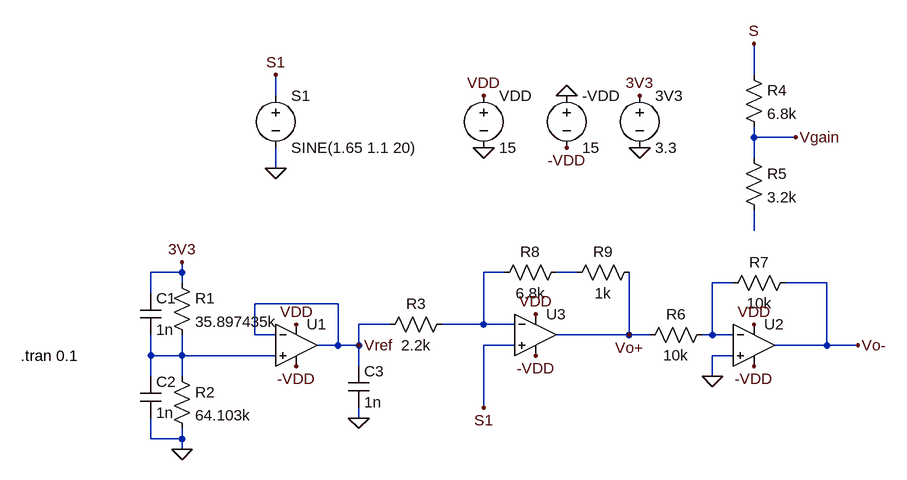
[diagram p0: schematic Arduino_mirror_adjust_1signal_non-inverting.asc]
Arduino_mirror_adjust_1signal_non-inverting.asc, the LTspice schematic file:
Version 4
SHEET 1 880 680
WIRE 624 -128 624 -176
WIRE -112 -96 -112 -128
WIRE 624 -32 624 -48
WIRE 688 -32 624 -32
WIRE 624 0 624 -32
WIRE -112 16 -112 -16
WIRE 624 112 624 80
WIRE -256 176 -256 160
WIRE -256 176 -304 176
WIRE 240 176 208 176
WIRE 352 176 320 176
WIRE -256 192 -256 176
WIRE 592 192 560 192
WIRE 736 192 672 192
WIRE -304 208 -304 176
WIRE -16 224 -144 224
WIRE 64 256 16 256
WIRE 208 256 208 176
WIRE 208 256 144 256
WIRE 256 256 208 256
WIRE -144 272 -144 224
WIRE -112 272 -144 272
WIRE 432 272 432 176
WIRE 432 272 320 272
WIRE 464 272 432 272
WIRE 560 272 560 192
WIRE 560 272 544 272
WIRE 592 272 560 272
WIRE -16 288 -16 224
WIRE -16 288 -48 288
WIRE 16 288 16 256
WIRE 16 288 -16 288
WIRE 256 288 208 288
WIRE 736 288 736 192
WIRE 736 288 656 288
WIRE 784 288 736 288
WIRE -304 304 -304 272
WIRE -256 304 -256 272
WIRE -256 304 -304 304
WIRE -112 304 -256 304
WIRE 592 304 560 304
WIRE 16 320 16 288
WIRE -304 336 -304 304
WIRE -256 336 -256 304
WIRE 560 336 560 304
WIRE 208 384 208 288
WIRE 16 400 16 384
WIRE -304 432 -304 400
WIRE -256 432 -256 416
WIRE -256 432 -304 432
WIRE -256 448 -256 432
FLAG 208 -16 0
FLAG -112 16 0
FLAG 448 -16 0
FLAG 208 -96 VDD
FLAG -256 448 0
FLAG 448 -96 3V3
FLAG -256 160 3V3
FLAG -112 -128 S1
FLAG 208 384 S1
FLAG 288 240 VDD
FLAG 624 -176 S
FLAG 688 -32 Vgain
FLAG 336 -96 0
FLAG 336 -16 -VDD
FLAG 288 304 -VDD
FLAG -80 320 -VDD
FLAG 624 320 -VDD
FLAG -80 256 VDD
FLAG 624 256 VDD
FLAG 560 336 0
FLAG 432 272 Vo+
FLAG 784 288 Vo-
FLAG 16 400 0
FLAG 16 288 Vref
SYMBOL Opamps\\UniversalOpamp2 -80 288 R0
SYMATTR InstName U1
SYMBOL Opamps\\UniversalOpamp2 624 288 R0
SYMATTR InstName U2
SYMBOL Opamps\\UniversalOpamp2 288 272 R0
SYMATTR InstName U3
SYMBOL voltage -112 -112 R0
WINDOW 123 0 0 Left 0
WINDOW 39 0 0 Left 0
SYMATTR InstName S1
SYMATTR Value SINE(1.65 1.1 20)
SYMBOL voltage 208 -112 R0
WINDOW 123 0 0 Left 0
WINDOW 39 0 0 Left 0
SYMATTR InstName VDD
SYMATTR Value 15
SYMBOL res -272 176 R0
SYMATTR InstName R1
SYMATTR Value 35.897435k
SYMBOL res -272 320 R0
SYMATTR InstName R2
SYMATTR Value 64.103k
SYMBOL voltage 448 -112 R0
WINDOW 123 0 0 Left 0
WINDOW 39 0 0 Left 0
SYMATTR InstName 3V3
SYMATTR Value 3.3
SYMBOL res 160 240 R90
WINDOW 0 0 56 VBottom 2
WINDOW 3 32 56 VTop 2
SYMATTR InstName R3
SYMATTR Value 2.2k
SYMBOL res 608 -144 R0
SYMATTR InstName R4
SYMATTR Value 6.8k
SYMBOL res 608 -16 R0
SYMATTR InstName R5
SYMATTR Value 3.2k
SYMBOL voltage 336 -112 R0
WINDOW 123 0 0 Left 0
WINDOW 39 0 0 Left 0
SYMATTR InstName -VDD
SYMATTR Value 15
SYMBOL res 560 256 R90
WINDOW 0 0 56 VBottom 2
WINDOW 3 32 56 VTop 2
SYMATTR InstName R6
SYMATTR Value 10k
SYMBOL res 688 176 R90
WINDOW 0 0 56 VBottom 2
WINDOW 3 32 56 VTop 2
SYMATTR InstName R7
SYMATTR Value 10k
SYMBOL cap -320 208 R0
SYMATTR InstName C1
SYMATTR Value 1n
SYMBOL cap -320 336 R0
SYMATTR InstName C2
SYMATTR Value 1n
SYMBOL cap 0 320 R0
SYMATTR InstName C3
SYMATTR Value 1n
SYMBOL res 336 160 R90
WINDOW 0 0 56 VBottom 2
WINDOW 3 32 56 VTop 2
SYMATTR InstName R8
SYMATTR Value 6.8k
SYMBOL res 448 160 R90
WINDOW 0 0 56 VBottom 2
WINDOW 3 32 56 VTop 2
SYMATTR InstName R9
SYMATTR Value 1k
TEXT -504 304 Left 2 !.tran 0.1

The netlist it stands for:
* Arduino_mirror_adjust_1signal_non-inverting.asc
XU1 N005 Vref VDD -VDD Vref level.2 Avol=1Meg GBW=10Meg Slew=10Meg ilimit=25m rail=0 Vos=0 phimargin=45 en=0 enk=0 in=0 ink=0 Rin=500Meg  ; pins IN+ IN- V+ V- OUT
XU2 0 N004 VDD -VDD Vo- level.2 Avol=1Meg GBW=10Meg Slew=10Meg ilimit=25m rail=0 Vos=0 phimargin=45 en=0 enk=0 in=0 ink=0 Rin=500Meg  ; pins IN+ IN- V+ V- OUT
XU3 S1 N002 VDD -VDD Vo+ level.2 Avol=1Meg GBW=10Meg Slew=10Meg ilimit=25m rail=0 Vos=0 phimargin=45 en=0 enk=0 in=0 ink=0 Rin=500Meg  ; pins IN+ IN- V+ V- OUT
V§S1 S1 0 SINE(1.65 1.1 20)
VDD VDD 0 15
R1 3V3 N005 35.897435k
R2 N005 0 64.103k
V§3V3 3V3 0 3.3
R3 N002 Vref 2.2k
R4 S Vgain 6.8k
R5 Vgain N001 3.2k
V§-VDD 0 -VDD 15
R6 N004 Vo+ 10k
R7 Vo- N004 10k
C1 3V3 N005 1n
C2 N005 0 1n
C3 Vref 0 1n
R8 N003 N002 6.8k
R9 Vo+ N003 1k
.tran 0.1
.lib UniversalOpamps2.sub
.backanno
.end